# EAGLE schematic AP4BP-module-breakout_rev_a-v7 (EAGLE 9.7.0)
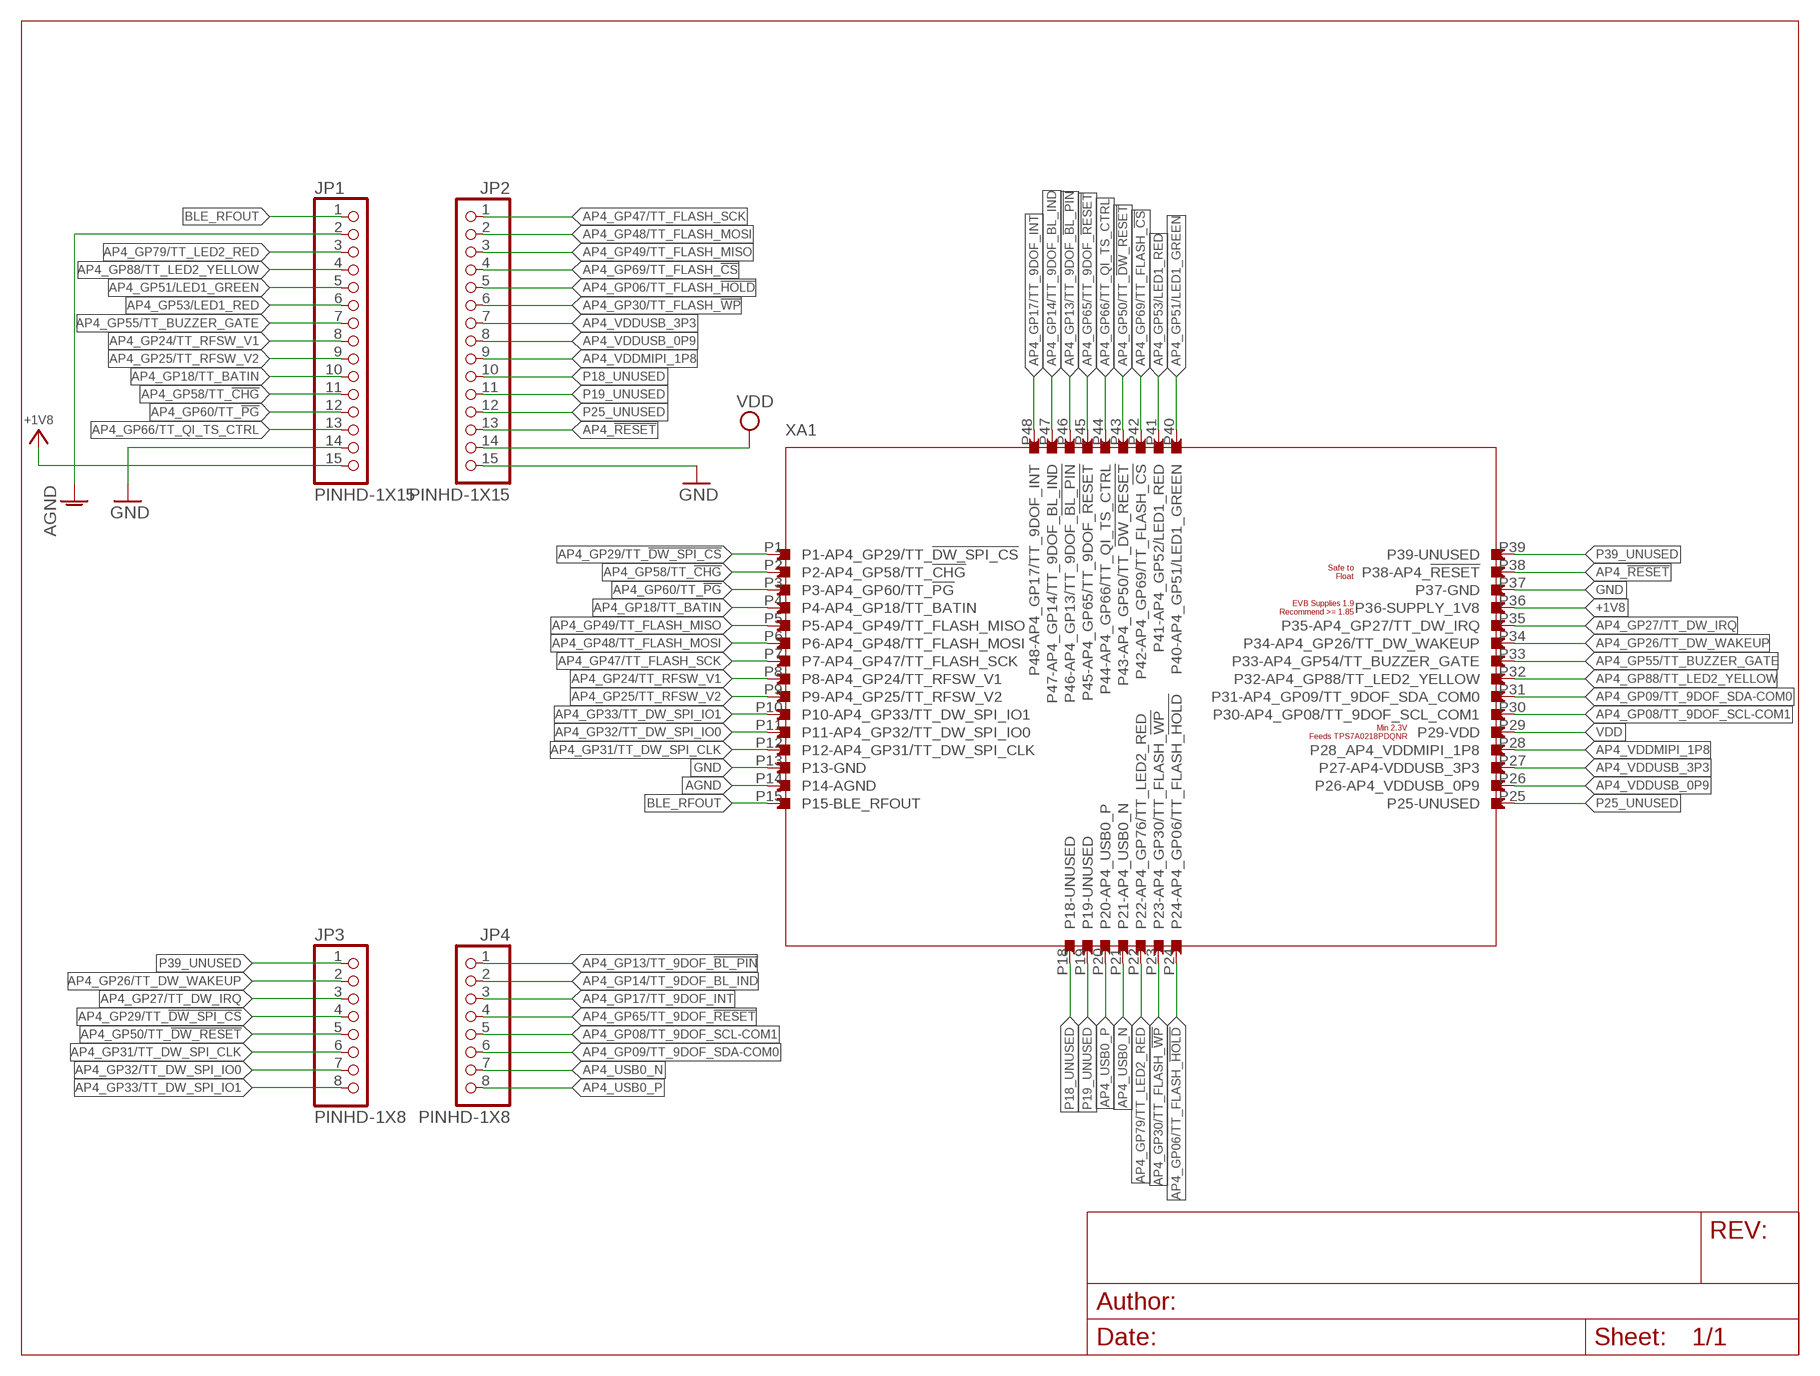
[diagram p0: schematic, sheet 1]

## Parts
JP1  PINHD-1X15  [1X15]
JP2  PINHD-1X15  [1X15]
JP3  PINHD-1X8  [1X08]
JP4  PINHD-1X8  [1X08]
XA1  APOLLO4_BLUEPLUS_MODULE  [APOLLO4_BLUEPLUS_MODULE]

## Nets
+1V8: JP1.15 XA1.P36(P36-SUPPLY_1V8)
AGND: JP1.2 XA1.P14(P14-AGND)
AP4_!RESET: JP2.13 XA1.P38(P38-AP4_!RESET)
AP4_GP06/TT_FLASH_!HOLD: JP2.5 XA1.P24(P24-AP4_GP06/TT_FLASH_!HOLD)
AP4_GP08/TT_9DOF_SCL-COM1: JP4.5 XA1.P30(P30-AP4_GP08/TT_9DOF_SCL_COM1)
AP4_GP09/TT_9DOF_SDA-COM0: JP4.6 XA1.P31(P31-AP4_GP09/TT_9DOF_SDA_COM0)
AP4_GP13/TT_9DOF_!BL_PIN: JP4.1 XA1.P46(P46-AP4_GP13/TT_9DOF_!BL_PIN)
AP4_GP14/TT_9DOF_BL_IND: JP4.2 XA1.P47(P47-AP4_GP14/TT_9DOF_BL_IND)
AP4_GP17/TT_9DOF_INT: JP4.3 XA1.P48(P48-AP4_GP17/TT_9DOF_INT)
AP4_GP18/TT_BATIN: JP1.10 XA1.P4(P4-AP4_GP18/TT_BATIN)
AP4_GP24/TT_RFSW_V1: JP1.8 XA1.P8(P8-AP4_GP24/TT_RFSW_V1)
AP4_GP25/TT_RFSW_V2: JP1.9 XA1.P9(P9-AP4_GP25/TT_RFSW_V2)
AP4_GP26/TT_DW_WAKEUP: JP3.2 XA1.P34(P34-AP4_GP26/TT_DW_WAKEUP)
AP4_GP27/TT_DW_IRQ: JP3.3 XA1.P35(P35-AP4_GP27/TT_DW_IRQ)
AP4_GP29/TT_!DW_SPI_CS: JP3.4 XA1.P1(P1-AP4_GP29/TT_!DW_SPI_CS)
AP4_GP30/TT_FLASH_!WP: JP2.6 XA1.P23(P23-AP4_GP30/TT_FLASH_!WP)
AP4_GP31/TT_DW_SPI_CLK: JP3.6 XA1.P12(P12-AP4_GP31/TT_DW_SPI_CLK)
AP4_GP32/TT_DW_SPI_IO0: JP3.7 XA1.P11(P11-AP4_GP32/TT_DW_SPI_IO0)
AP4_GP33/TT_DW_SPI_IO1: JP3.8 XA1.P10(P10-AP4_GP33/TT_DW_SPI_IO1)
AP4_GP47/TT_FLASH_SCK: JP2.1 XA1.P7(P7-AP4_GP47/TT_FLASH_SCK)
AP4_GP48/TT_FLASH_MOSI: JP2.2 XA1.P6(P6-AP4_GP48/TT_FLASH_MOSI)
AP4_GP49/TT_FLASH_MISO: JP2.3 XA1.P5(P5-AP4_GP49/TT_FLASH_MISO)
AP4_GP50/TT_!DW_RESET: JP3.5 XA1.P43(P43-AP4_GP50/TT_!DW_RESET)
AP4_GP51/LED1_GREEN: JP1.5 XA1.P40(P40-AP4_GP51/LED1_GREEN)
AP4_GP53/LED1_RED: JP1.6 XA1.P41(P41-AP4_GP52/LED1_RED)
AP4_GP55/TT_BUZZER_GATE: JP1.7 XA1.P33(P33-AP4_GP54/TT_BUZZER_GATE)
AP4_GP58/TT_!CHG: JP1.11 XA1.P2(P2-AP4_GP58/TT_!CHG)
AP4_GP60/TT_!PG: JP1.12 XA1.P3(P3-AP4_GP60/TT_!PG)
AP4_GP65/TT_9DOF_!RESET: JP4.4 XA1.P45(P45-AP4_GP65/TT_9DOF_!RESET)
AP4_GP66/TT_QI_TS_CTRL: JP1.13 XA1.P44(P44-AP4_GP66/TT_QI_TS_CTRL)
AP4_GP69/TT_FLASH_!CS: JP2.4 XA1.P42(P42-AP4_GP69/TT_FLASH_!CS)
AP4_GP79/TT_LED2_RED: JP1.3 XA1.P22(P22-AP4_GP76/TT_LED2_RED)
AP4_GP88/TT_LED2_YELLOW: JP1.4 XA1.P32(P32-AP4_GP88/TT_LED2_YELLOW)
AP4_USB0_N [USB_PHY]: JP4.7 XA1.P21(P21-AP4_USB0_N)
AP4_USB0_P [USB_PHY]: JP4.8 XA1.P20(P20-AP4_USB0_P)
AP4_VDDMIPI_1P8: JP2.9 XA1.P28(P28_AP4_VDDMIPI_1P8)
AP4_VDDUSB_0P9: JP2.8 XA1.P26(P26-AP4_VDDUSB_0P9)
AP4_VDDUSB_3P3: JP2.7 XA1.P27(P27-AP4-VDDUSB_3P3)
BLE_RFOUT [BLE_PHY]: JP1.1 XA1.P15(P15-BLE_RFOUT)
GND: JP1.14 JP2.15 XA1.P13(P13-GND) XA1.P37(P37-GND)
P18_UNUSED: JP2.10 XA1.P18(P18-UNUSED)
P19_UNUSED: JP2.11 XA1.P19(P19-UNUSED)
P25_UNUSED: JP2.12 XA1.P25(P25-UNUSED)
P39_UNUSED: JP3.1 XA1.P39(P39-UNUSED)
VDD: JP2.14 XA1.P29(P29-VDD)

## Library data of the parts
JP1 = Connector:PINHD-1X15: PIN HEADER; CATEGORY: Headers; DESCRIPTION: Header, Straight, 15 Position; MANUFACTURER: Generic; MPN: Generic; OPERATING_TEMPERATURE: Generic; PART_STATUS: Active; PITCH: 0.100" (2.54mm); ROHS_COMPLIANCE: Generic; SERIES: Generic; SUB-CATEGORY: Headers, Male Pins; TYPE: Board to Board or Cable, Unshrouded, Through Hole, Straight
JP2 = Connector:PINHD-1X15: PIN HEADER; CATEGORY: CONNECTOR; SUB-CATEGORY: PIN-HEADER
JP3 JP4 = Connector:PINHD-1X8: PIN HEADER; CATEGORY: CONNECTOR; SUB-CATEGORY: PIN-HEADER
XA1 = Quorvo:APOLLO4_BLUEPLUS_MODULE